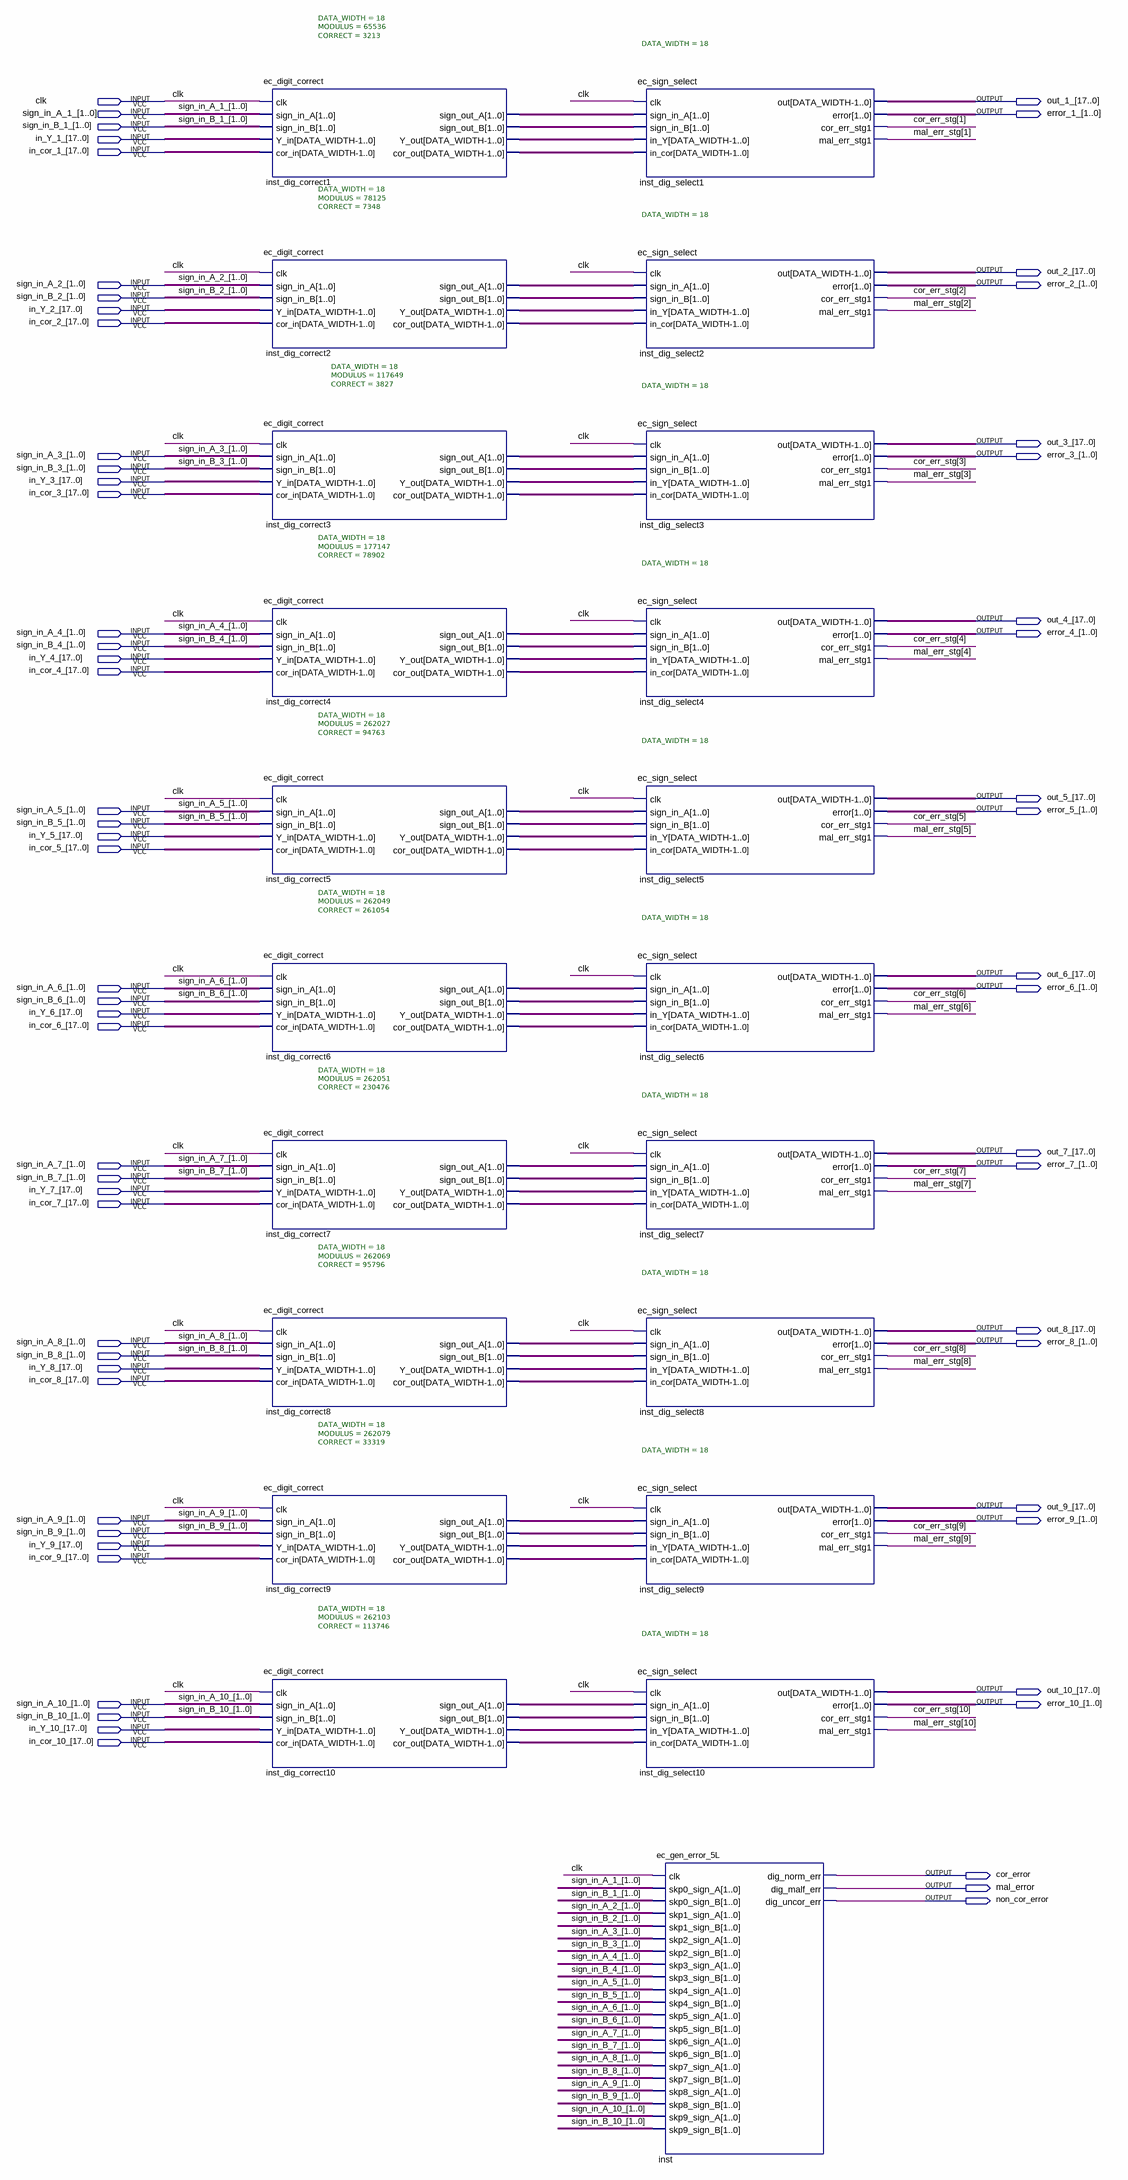
[diagram p0: schematic sheet]
// Quartus schematic ec_correct_select18x10.bdf as structural Verilog: 21 symbols, 64 pins
module ec_correct_select18x10 (
  input  clk,
  input  [1:0] sign_in_A_1_,
  input  [1:0] sign_in_B_1_,
  input  [17:0] in_Y_1_,
  input  [17:0] in_cor_1_,
  input  [1:0] sign_in_A_2_,
  input  [1:0] sign_in_B_2_,
  input  [17:0] in_Y_2_,
  input  [17:0] in_cor_2_,
  input  [1:0] sign_in_A_3_,
  input  [1:0] sign_in_B_3_,
  input  [17:0] in_Y_3_,
  input  [17:0] in_cor_3_,
  input  [1:0] sign_in_A_4_,
  input  [1:0] sign_in_B_4_,
  input  [17:0] in_Y_4_,
  input  [17:0] in_cor_4_,
  input  [1:0] sign_in_A_5_,
  input  [1:0] sign_in_B_5_,
  input  [17:0] in_Y_5_,
  input  [17:0] in_cor_5_,
  input  [1:0] sign_in_A_6_,
  input  [1:0] sign_in_B_6_,
  input  [17:0] in_Y_6_,
  input  [17:0] in_cor_6_,
  input  [1:0] sign_in_A_7_,
  input  [1:0] sign_in_B_7_,
  input  [17:0] in_Y_7_,
  input  [17:0] in_cor_7_,
  input  [1:0] sign_in_A_8_,
  input  [1:0] sign_in_B_8_,
  input  [17:0] in_Y_8_,
  input  [17:0] in_cor_8_,
  input  [1:0] sign_in_A_9_,
  input  [1:0] sign_in_B_9_,
  input  [17:0] in_Y_9_,
  input  [17:0] in_cor_9_,
  input  [1:0] sign_in_A_10_,
  input  [1:0] sign_in_B_10_,
  input  [17:0] in_Y_10_,
  input  [17:0] in_cor_10_,
  output [17:0] out_1_,
  output [1:0] error_1_,
  output [17:0] out_2_,
  output [1:0] error_2_,
  output [17:0] out_3_,
  output [1:0] error_3_,
  output [17:0] out_4_,
  output [1:0] error_4_,
  output [17:0] out_5_,
  output [1:0] error_5_,
  output [17:0] out_6_,
  output [1:0] error_6_,
  output [17:0] out_7_,
  output [1:0] error_7_,
  output [17:0] out_8_,
  output [1:0] error_8_,
  output [17:0] out_9_,
  output [1:0] error_9_,
  output [17:0] out_10_,
  output [1:0] error_10_,
  output cor_error,
  output mal_error,
  output non_cor_error
);

  wire [1:0] inst_dig_correct1_sign_out_a, inst_dig_correct1_sign_out_b, inst_dig_correct2_sign_out_a,
       inst_dig_correct2_sign_out_b, inst_dig_correct3_sign_out_a, inst_dig_correct3_sign_out_b,
       inst_dig_correct4_sign_out_a, inst_dig_correct4_sign_out_b, inst_dig_correct5_sign_out_a,
       inst_dig_correct5_sign_out_b, inst_dig_correct6_sign_out_a, inst_dig_correct6_sign_out_b,
       inst_dig_correct7_sign_out_a, inst_dig_correct7_sign_out_b, inst_dig_correct8_sign_out_a,
       inst_dig_correct8_sign_out_b, inst_dig_correct9_sign_out_a, inst_dig_correct9_sign_out_b,
       inst_dig_correct10_sign_out_a, inst_dig_correct10_sign_out_b;
  wire [10:1] cor_err_stg, mal_err_stg;
  wire [17:0] inst_dig_correct1_cor_out, inst_dig_correct1_y_out, inst_dig_correct2_cor_out,
       inst_dig_correct2_y_out, inst_dig_correct3_cor_out, inst_dig_correct3_y_out,
       inst_dig_correct4_cor_out, inst_dig_correct4_y_out, inst_dig_correct5_cor_out,
       inst_dig_correct5_y_out, inst_dig_correct6_cor_out, inst_dig_correct6_y_out,
       inst_dig_correct7_cor_out, inst_dig_correct7_y_out, inst_dig_correct8_cor_out,
       inst_dig_correct8_y_out, inst_dig_correct9_cor_out, inst_dig_correct9_y_out,
       inst_dig_correct10_cor_out, inst_dig_correct10_y_out;

  ec_digit_correct #(.DATA_WIDTH(18), .MODULUS(65536), .CORRECT(3213)) inst_dig_correct1 (
    .clk(clk), .sign_in_A(sign_in_A_1_), .sign_in_B(sign_in_B_1_), .Y_in(in_Y_1_), .cor_in(in_cor_1_),
    .sign_out_A(inst_dig_correct1_sign_out_a), .sign_out_B(inst_dig_correct1_sign_out_b),
    .Y_out(inst_dig_correct1_y_out), .cor_out(inst_dig_correct1_cor_out));
  ec_digit_correct #(.DATA_WIDTH(18), .MODULUS(78125), .CORRECT(7348)) inst_dig_correct2 (
    .clk(clk), .sign_in_A(sign_in_A_2_), .sign_in_B(sign_in_B_2_), .Y_in(in_Y_2_), .cor_in(in_cor_2_),
    .sign_out_A(inst_dig_correct2_sign_out_a), .sign_out_B(inst_dig_correct2_sign_out_b),
    .Y_out(inst_dig_correct2_y_out), .cor_out(inst_dig_correct2_cor_out));
  ec_digit_correct #(.DATA_WIDTH(18), .MODULUS(117649), .CORRECT(3827)) inst_dig_correct3 (
    .clk(clk), .sign_in_A(sign_in_A_3_), .sign_in_B(sign_in_B_3_), .Y_in(in_Y_3_), .cor_in(in_cor_3_),
    .sign_out_A(inst_dig_correct3_sign_out_a), .sign_out_B(inst_dig_correct3_sign_out_b),
    .Y_out(inst_dig_correct3_y_out), .cor_out(inst_dig_correct3_cor_out));
  ec_digit_correct #(.DATA_WIDTH(18), .MODULUS(177147), .CORRECT(78902)) inst_dig_correct4 (
    .clk(clk), .sign_in_A(sign_in_A_4_), .sign_in_B(sign_in_B_4_), .Y_in(in_Y_4_), .cor_in(in_cor_4_),
    .sign_out_A(inst_dig_correct4_sign_out_a), .sign_out_B(inst_dig_correct4_sign_out_b),
    .Y_out(inst_dig_correct4_y_out), .cor_out(inst_dig_correct4_cor_out));
  ec_digit_correct #(.DATA_WIDTH(18), .MODULUS(262027), .CORRECT(94763)) inst_dig_correct5 (
    .clk(clk), .sign_in_A(sign_in_A_5_), .sign_in_B(sign_in_B_5_), .Y_in(in_Y_5_), .cor_in(in_cor_5_),
    .sign_out_A(inst_dig_correct5_sign_out_a), .sign_out_B(inst_dig_correct5_sign_out_b),
    .Y_out(inst_dig_correct5_y_out), .cor_out(inst_dig_correct5_cor_out));
  ec_digit_correct #(.DATA_WIDTH(18), .MODULUS(262049), .CORRECT(261054)) inst_dig_correct6 (
    .clk(clk), .sign_in_A(sign_in_A_6_), .sign_in_B(sign_in_B_6_), .Y_in(in_Y_6_), .cor_in(in_cor_6_),
    .sign_out_A(inst_dig_correct6_sign_out_a), .sign_out_B(inst_dig_correct6_sign_out_b),
    .Y_out(inst_dig_correct6_y_out), .cor_out(inst_dig_correct6_cor_out));
  ec_digit_correct #(.DATA_WIDTH(18), .MODULUS(262051), .CORRECT(230476)) inst_dig_correct7 (
    .clk(clk), .sign_in_A(sign_in_A_7_), .sign_in_B(sign_in_B_7_), .Y_in(in_Y_7_), .cor_in(in_cor_7_),
    .sign_out_A(inst_dig_correct7_sign_out_a), .sign_out_B(inst_dig_correct7_sign_out_b),
    .Y_out(inst_dig_correct7_y_out), .cor_out(inst_dig_correct7_cor_out));
  ec_digit_correct #(.DATA_WIDTH(18), .MODULUS(262069), .CORRECT(95796)) inst_dig_correct8 (
    .clk(clk), .sign_in_A(sign_in_A_8_), .sign_in_B(sign_in_B_8_), .Y_in(in_Y_8_), .cor_in(in_cor_8_),
    .sign_out_A(inst_dig_correct8_sign_out_a), .sign_out_B(inst_dig_correct8_sign_out_b),
    .Y_out(inst_dig_correct8_y_out), .cor_out(inst_dig_correct8_cor_out));
  ec_digit_correct #(.DATA_WIDTH(18), .MODULUS(262079), .CORRECT(33319)) inst_dig_correct9 (
    .clk(clk), .sign_in_A(sign_in_A_9_), .sign_in_B(sign_in_B_9_), .Y_in(in_Y_9_), .cor_in(in_cor_9_),
    .sign_out_A(inst_dig_correct9_sign_out_a), .sign_out_B(inst_dig_correct9_sign_out_b),
    .Y_out(inst_dig_correct9_y_out), .cor_out(inst_dig_correct9_cor_out));
  ec_digit_correct #(.DATA_WIDTH(18), .MODULUS(262103), .CORRECT(113746)) inst_dig_correct10 (
    .clk(clk), .sign_in_A(sign_in_A_10_), .sign_in_B(sign_in_B_10_), .Y_in(in_Y_10_), .cor_in(in_cor_10_),
    .sign_out_A(inst_dig_correct10_sign_out_a), .sign_out_B(inst_dig_correct10_sign_out_b),
    .Y_out(inst_dig_correct10_y_out), .cor_out(inst_dig_correct10_cor_out));
  ec_sign_select #(.DATA_WIDTH(18)) inst_dig_select1 (
    .clk(clk), .sign_in_A(inst_dig_correct1_sign_out_a), .sign_in_B(inst_dig_correct1_sign_out_b),
    .in_Y(inst_dig_correct1_y_out), .in_cor(inst_dig_correct1_cor_out), .out(out_1_), .error(error_1_),
    .cor_err_stg1(cor_err_stg[1]), .mal_err_stg1(mal_err_stg[1]));
  ec_sign_select #(.DATA_WIDTH(18)) inst_dig_select2 (
    .clk(clk), .sign_in_A(inst_dig_correct2_sign_out_a), .sign_in_B(inst_dig_correct2_sign_out_b),
    .in_Y(inst_dig_correct2_y_out), .in_cor(inst_dig_correct2_cor_out), .out(out_2_), .error(error_2_),
    .cor_err_stg1(cor_err_stg[2]), .mal_err_stg1(mal_err_stg[2]));
  ec_sign_select #(.DATA_WIDTH(18)) inst_dig_select3 (
    .clk(clk), .sign_in_A(inst_dig_correct3_sign_out_a), .sign_in_B(inst_dig_correct3_sign_out_b),
    .in_Y(inst_dig_correct3_y_out), .in_cor(inst_dig_correct3_cor_out), .out(out_3_), .error(error_3_),
    .cor_err_stg1(cor_err_stg[3]), .mal_err_stg1(mal_err_stg[3]));
  ec_sign_select #(.DATA_WIDTH(18)) inst_dig_select4 (
    .clk(clk), .sign_in_A(inst_dig_correct4_sign_out_a), .sign_in_B(inst_dig_correct4_sign_out_b),
    .in_Y(inst_dig_correct4_y_out), .in_cor(inst_dig_correct4_cor_out), .out(out_4_), .error(error_4_),
    .cor_err_stg1(cor_err_stg[4]), .mal_err_stg1(mal_err_stg[4]));
  ec_sign_select #(.DATA_WIDTH(18)) inst_dig_select5 (
    .clk(clk), .sign_in_A(inst_dig_correct5_sign_out_a), .sign_in_B(inst_dig_correct5_sign_out_b),
    .in_Y(inst_dig_correct5_y_out), .in_cor(inst_dig_correct5_cor_out), .out(out_5_), .error(error_5_),
    .cor_err_stg1(cor_err_stg[5]), .mal_err_stg1(mal_err_stg[5]));
  ec_sign_select #(.DATA_WIDTH(18)) inst_dig_select6 (
    .clk(clk), .sign_in_A(inst_dig_correct6_sign_out_a), .sign_in_B(inst_dig_correct6_sign_out_b),
    .in_Y(inst_dig_correct6_y_out), .in_cor(inst_dig_correct6_cor_out), .out(out_6_), .error(error_6_),
    .cor_err_stg1(cor_err_stg[6]), .mal_err_stg1(mal_err_stg[6]));
  ec_sign_select #(.DATA_WIDTH(18)) inst_dig_select7 (
    .clk(clk), .sign_in_A(inst_dig_correct7_sign_out_a), .sign_in_B(inst_dig_correct7_sign_out_b),
    .in_Y(inst_dig_correct7_y_out), .in_cor(inst_dig_correct7_cor_out), .out(out_7_), .error(error_7_),
    .cor_err_stg1(cor_err_stg[7]), .mal_err_stg1(mal_err_stg[7]));
  ec_sign_select #(.DATA_WIDTH(18)) inst_dig_select8 (
    .clk(clk), .sign_in_A(inst_dig_correct8_sign_out_a), .sign_in_B(inst_dig_correct8_sign_out_b),
    .in_Y(inst_dig_correct8_y_out), .in_cor(inst_dig_correct8_cor_out), .out(out_8_), .error(error_8_),
    .cor_err_stg1(cor_err_stg[8]), .mal_err_stg1(mal_err_stg[8]));
  ec_sign_select #(.DATA_WIDTH(18)) inst_dig_select9 (
    .clk(clk), .sign_in_A(inst_dig_correct9_sign_out_a), .sign_in_B(inst_dig_correct9_sign_out_b),
    .in_Y(inst_dig_correct9_y_out), .in_cor(inst_dig_correct9_cor_out), .out(out_9_), .error(error_9_),
    .cor_err_stg1(cor_err_stg[9]), .mal_err_stg1(mal_err_stg[9]));
  ec_sign_select #(.DATA_WIDTH(18)) inst_dig_select10 (
    .clk(clk), .sign_in_A(inst_dig_correct10_sign_out_a), .sign_in_B(inst_dig_correct10_sign_out_b),
    .in_Y(inst_dig_correct10_y_out), .in_cor(inst_dig_correct10_cor_out), .out(out_10_), .error(error_10_),
    .cor_err_stg1(cor_err_stg[10]), .mal_err_stg1(mal_err_stg[10]));
  ec_gen_error_5L inst (
    .clk(clk), .skp0_sign_A(sign_in_A_1_), .skp0_sign_B(sign_in_B_1_), .skp1_sign_A(sign_in_A_2_),
    .skp1_sign_B(sign_in_B_2_), .skp2_sign_A(sign_in_A_3_), .skp2_sign_B(sign_in_B_3_),
    .skp3_sign_A(sign_in_A_4_), .skp3_sign_B(sign_in_B_4_), .skp4_sign_A(sign_in_A_5_),
    .skp4_sign_B(sign_in_B_5_), .skp5_sign_A(sign_in_A_6_), .skp5_sign_B(sign_in_B_6_),
    .skp6_sign_A(sign_in_A_7_), .skp6_sign_B(sign_in_B_7_), .skp7_sign_A(sign_in_A_8_),
    .skp7_sign_B(sign_in_B_8_), .skp8_sign_A(sign_in_A_9_), .skp8_sign_B(sign_in_B_9_),
    .skp9_sign_A(sign_in_A_10_), .skp9_sign_B(sign_in_B_10_), .dig_norm_err(cor_error),
    .dig_malf_err(mal_error), .dig_uncor_err(non_cor_error));
endmodule
